# EAGLE design mbed-cmsis (EAGLE 7.2.0)
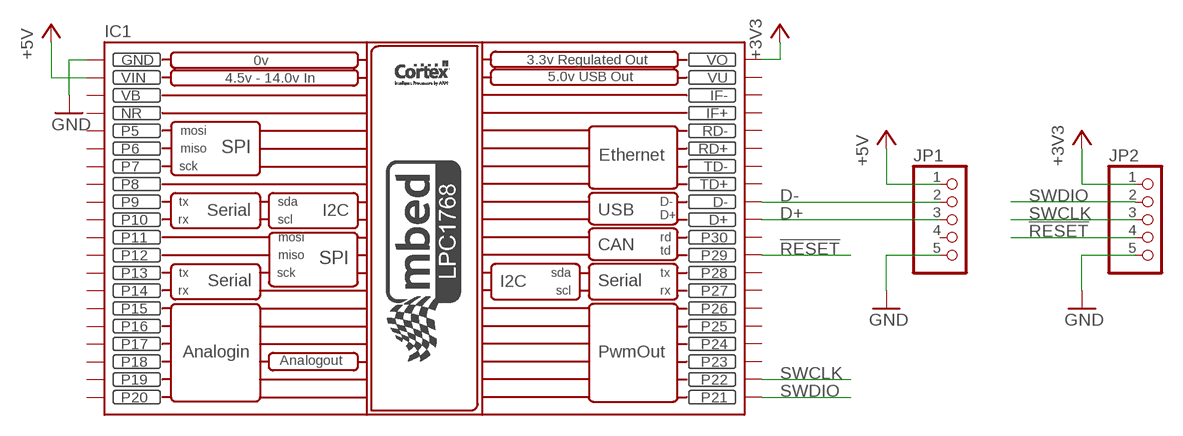
[diagram p0: schematic, sheet 1]

## Parts
IC1  MBED_NXP_LPC1768  [MBED-KIT]
JP1  PINHD-1X5  [1X05]
JP2  PINHD-1X5  [1X05]

## Nets
!RESET!: IC1.P$29(P29) JP2.4
+3V3: IC1.VOUT(VO) JP2.1
+5V: IC1.VIN JP1.1
D+: IC1.D+ JP1.3
D-: IC1.D- JP1.2
GND: IC1.GND JP1.5 JP2.5
SWCLK: IC1.P$22(P22) JP2.3
SWDIO: IC1.P$21(P21) JP2.2
Unconnected: IC1.IF+ IC1.IF- IC1.P$5(P5) IC1.P$6(P6) IC1.P$7(P7) IC1.P$8(P8) IC1.P$9(P9) IC1.P$10(P10) IC1.P$11(P11) IC1.P$12(P12) IC1.P$13(P13) IC1.P$14(P14) IC1.P$15(P15) IC1.P$16(P16) IC1.P$17(P17) IC1.P$18(P18) IC1.P$19(P19) IC1.P$20(P20) IC1.P$23(P23) IC1.P$24(P24) IC1.P$25(P25) IC1.P$26(P26) IC1.P$27(P27) IC1.P$28(P28) IC1.P$30(P30) IC1.RD+ IC1.RD- IC1.TD+ IC1.TD- JP1.4

## Power pins joined to a net without a drawn wire
NR: IC1.NR
VB: IC1.VB
VU: IC1.VU

## Library data of the parts
IC1 = MBED_v2.1:MBED_NXP_LPC1768: Mbed LPC1768 - ARM CORTEX v2.1 * Schematic symbol is now placed in eagles's default raster. *The pads diameter are suitable for routing between mbed pins * mbed pads are 0.8 mm drill diameter. --------------------------------------------- Created by: Mohamed Yousry *Alexandria, Egypt *Email: mohamed.yousry@ieeegoldegypt.org
JP1 JP2 = pinhead:PINHD-1X5: PIN HEADER

## Board
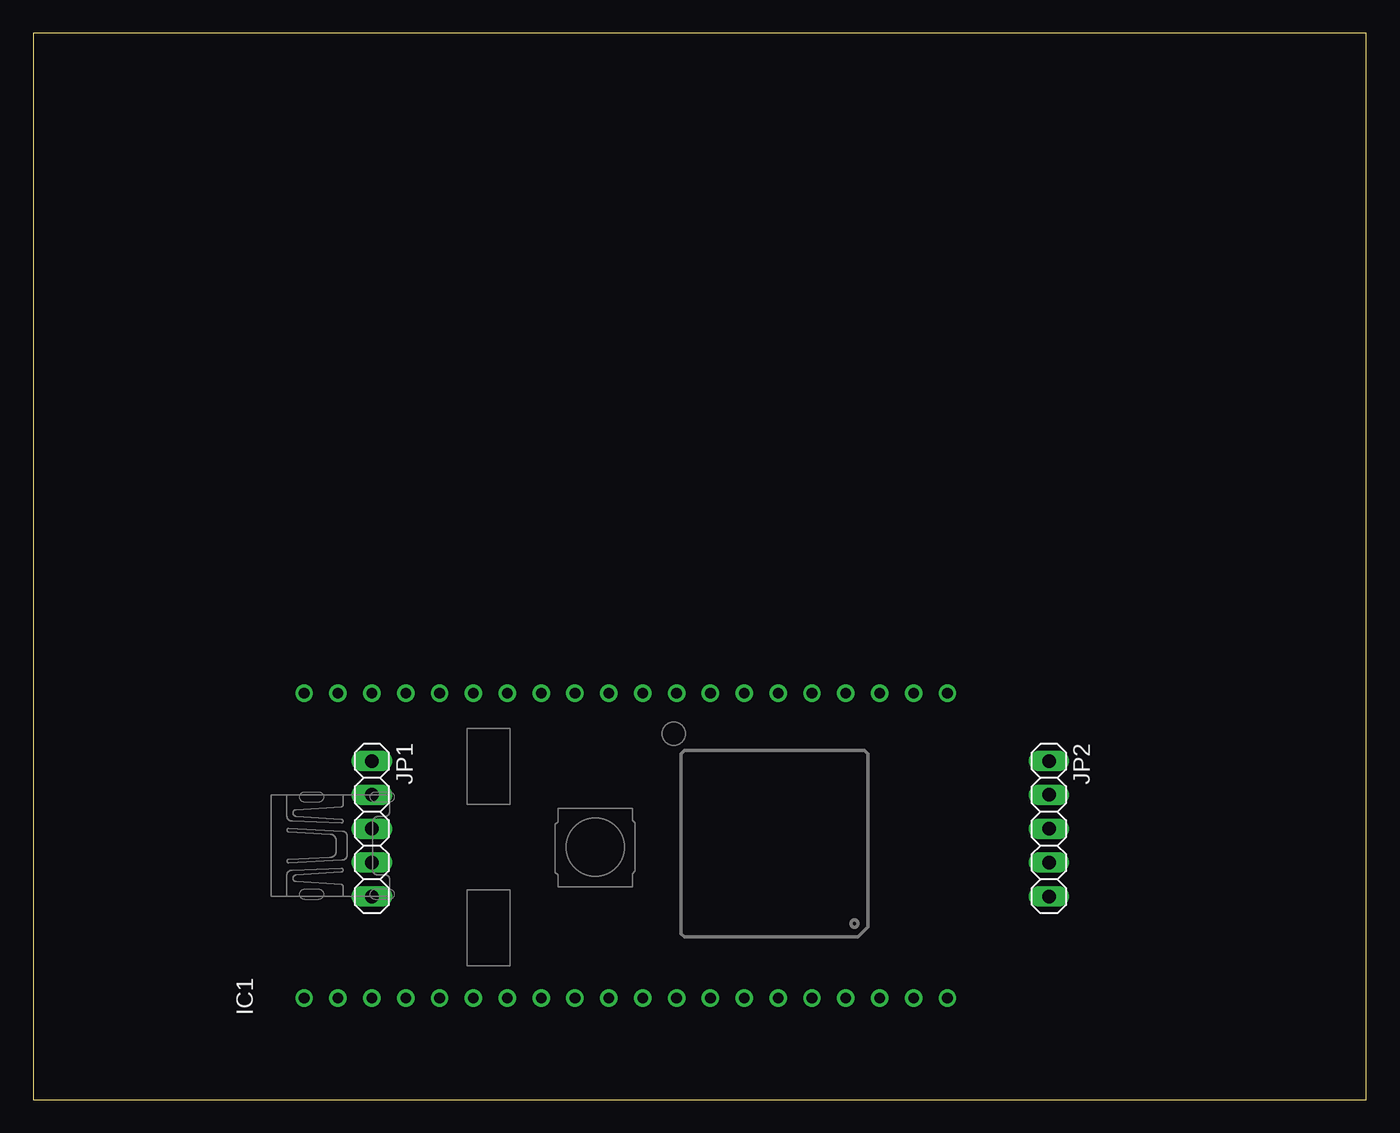
[diagram p1: board, top side]
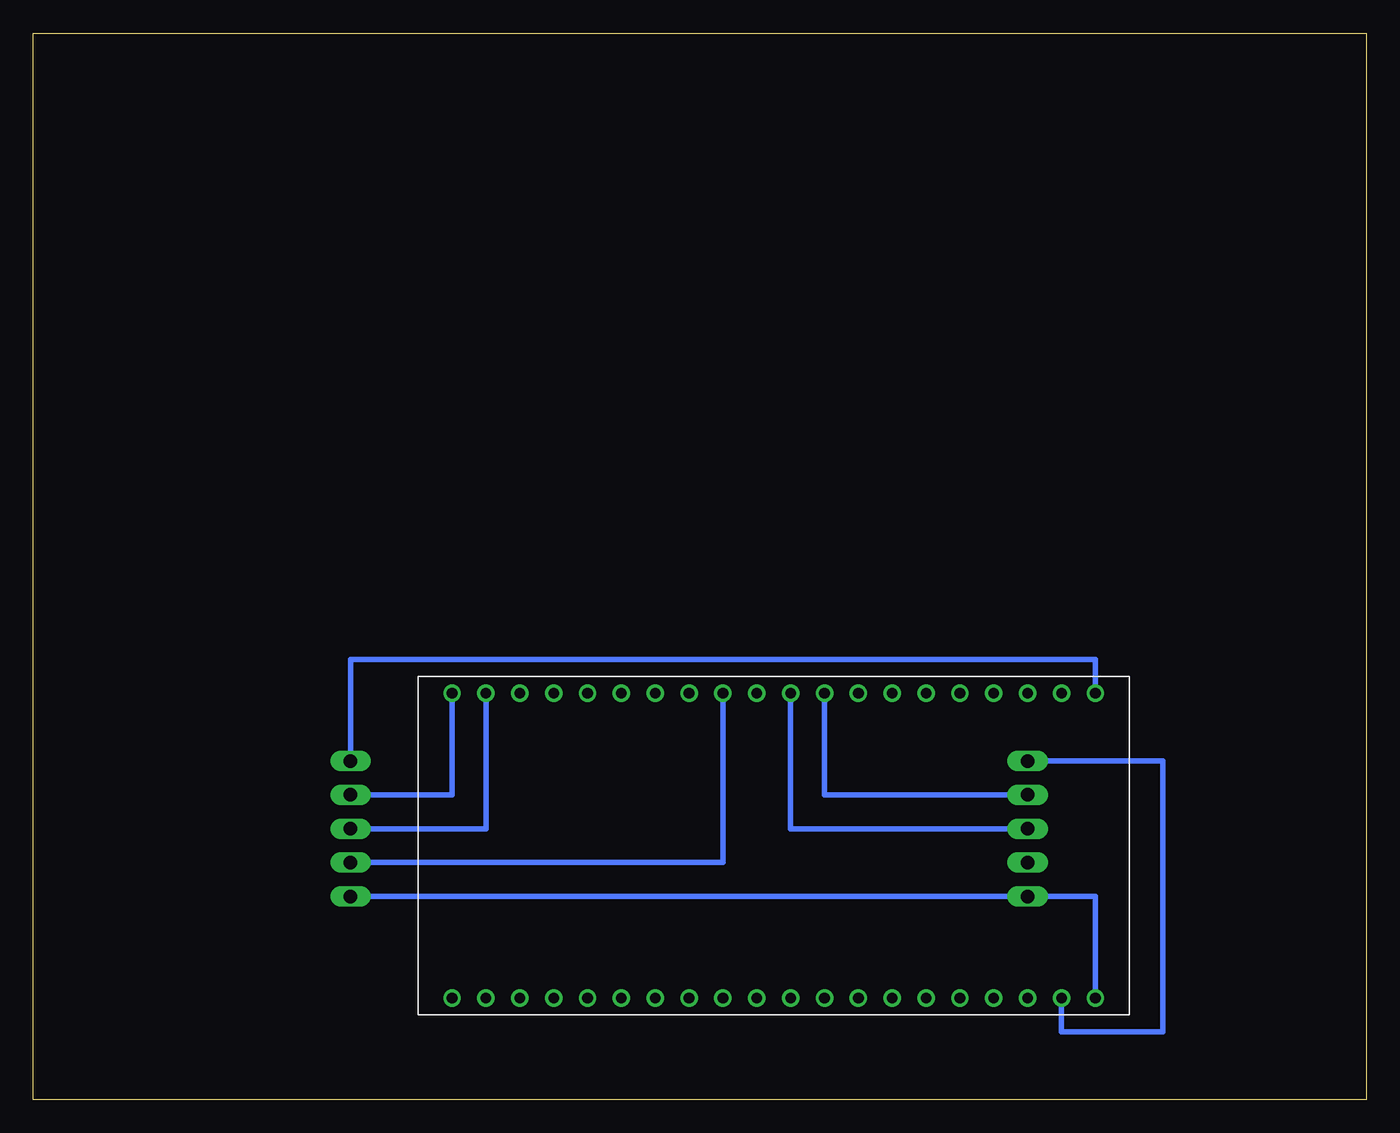
[diagram p2: board, bottom side, seen from below]

Size 100 x 80 mm. Coordinates in mm from the lower left corner, seen from the top.
Outline: 0,0 100,0 100,80 0,80 0,0
Copper layers (1*16): Top 0.035mm / dielectric 1.5mm / Bottom 0.035mm
Design rules "default": minimum track width 10mil, minimum drill 24mil, track to track 8mil, track to pad 8mil, pad to pad 8mil, via to via 8mil, smd to smd 8mil, copper to edge 40mil, drill to drill 8mil, minimum pad ring 10mil, minimum via ring 8mil, stop-mask expansion 4mil, vias tented up to drill 0mil, thermal gap 10mil

### Footprints (pad centres in the part's own frame; a part is rotated, then mirrored left to right if it is on the bottom)
MBED-KIT = drill 0.8: D+ 11.43,1.27; D- 11.43,3.81; GND -11.43,24.13; IF+ 11.43,16.51; IF- 11.43,19.05; NR -11.43,16.51; P$5 -11.43,13.97; P$6 -11.43,11.43; P$7 -11.43,8.89; P$8 -11.43,6.35; P$9 -11.43,3.81; P$10 -11.43,1.27; P$11 -11.43,-1.27; P$12 -11.43,-3.81; P$13 -11.43,-6.35; P$14 -11.43,-8.89; P$15 -11.43,-11.43; P$16 -11.43,-13.97; P$17 -11.43,-16.51; P$18 -11.43,-19.05; P$19 -11.43,-21.59; P$20 -11.43,-24.13; P$21 11.43,-24.13; P$22 11.43,-21.59; P$23 11.43,-19.05; P$24 11.43,-16.51; P$25 11.43,-13.97; P$26 11.43,-11.43; P$27 11.43,-8.89; P$28 11.43,-6.35; P$29 11.43,-3.81; P$30 11.43,-1.27; RD+ 11.43,11.43; RD- 11.43,13.97; TD+ 11.43,6.35; TD- 11.43,8.89; VB -11.43,19.05; VIN -11.43,21.59; VOUT 11.43,24.13; VU 11.43,21.59
1X05 = drill 1.016 long: 1 -5.08,0; 2 -2.54,0; 3 0,0; 4 2.54,0; 5 5.08,0

### Placement (x,y rotation side)
IC1  44.45,19.05 90 top
JP1  25.4,20.32 270 top
JP2  76.2,20.32 270 top

### Tracks (layer width: path | path; a pad name or v marks a point on that pad's centre or on a via)
!RESET!
  Bottom 0.406: IC1.P$29 48.26,17.78 JP2.4
+3V3
  Bottom 0.406: IC1.VOUT 20.32,33.02 76.2,33.02 JP2.1
+5V
  Bottom 0.406: IC1.VIN 22.86,5.08 15.24,5.08 15.24,25.4 JP1.1
D+
  Bottom 0.406: IC1.D+ 43.18,20.32 JP1.3
D-
  Bottom 0.406: JP1.2 40.64,22.86 IC1.D-
GND
  Bottom 0.406: IC1.GND 20.32,15.24 JP1.5 JP2.5
SWCLK
  Bottom 0.406: IC1.P$22 66.04,20.32 JP2.3
SWDIO
  Bottom 0.406: IC1.P$21 68.58,22.86 JP2.2